# EasyEDA Pro project 51最小开发板.epro

# Schematic Schematic1
Board Name: Board1; Create Date: 2024-08-09; Page Name: P1; Project Name: 51最小开发板; Schematic Name: Schematic1; Update Date: 2024-08-25
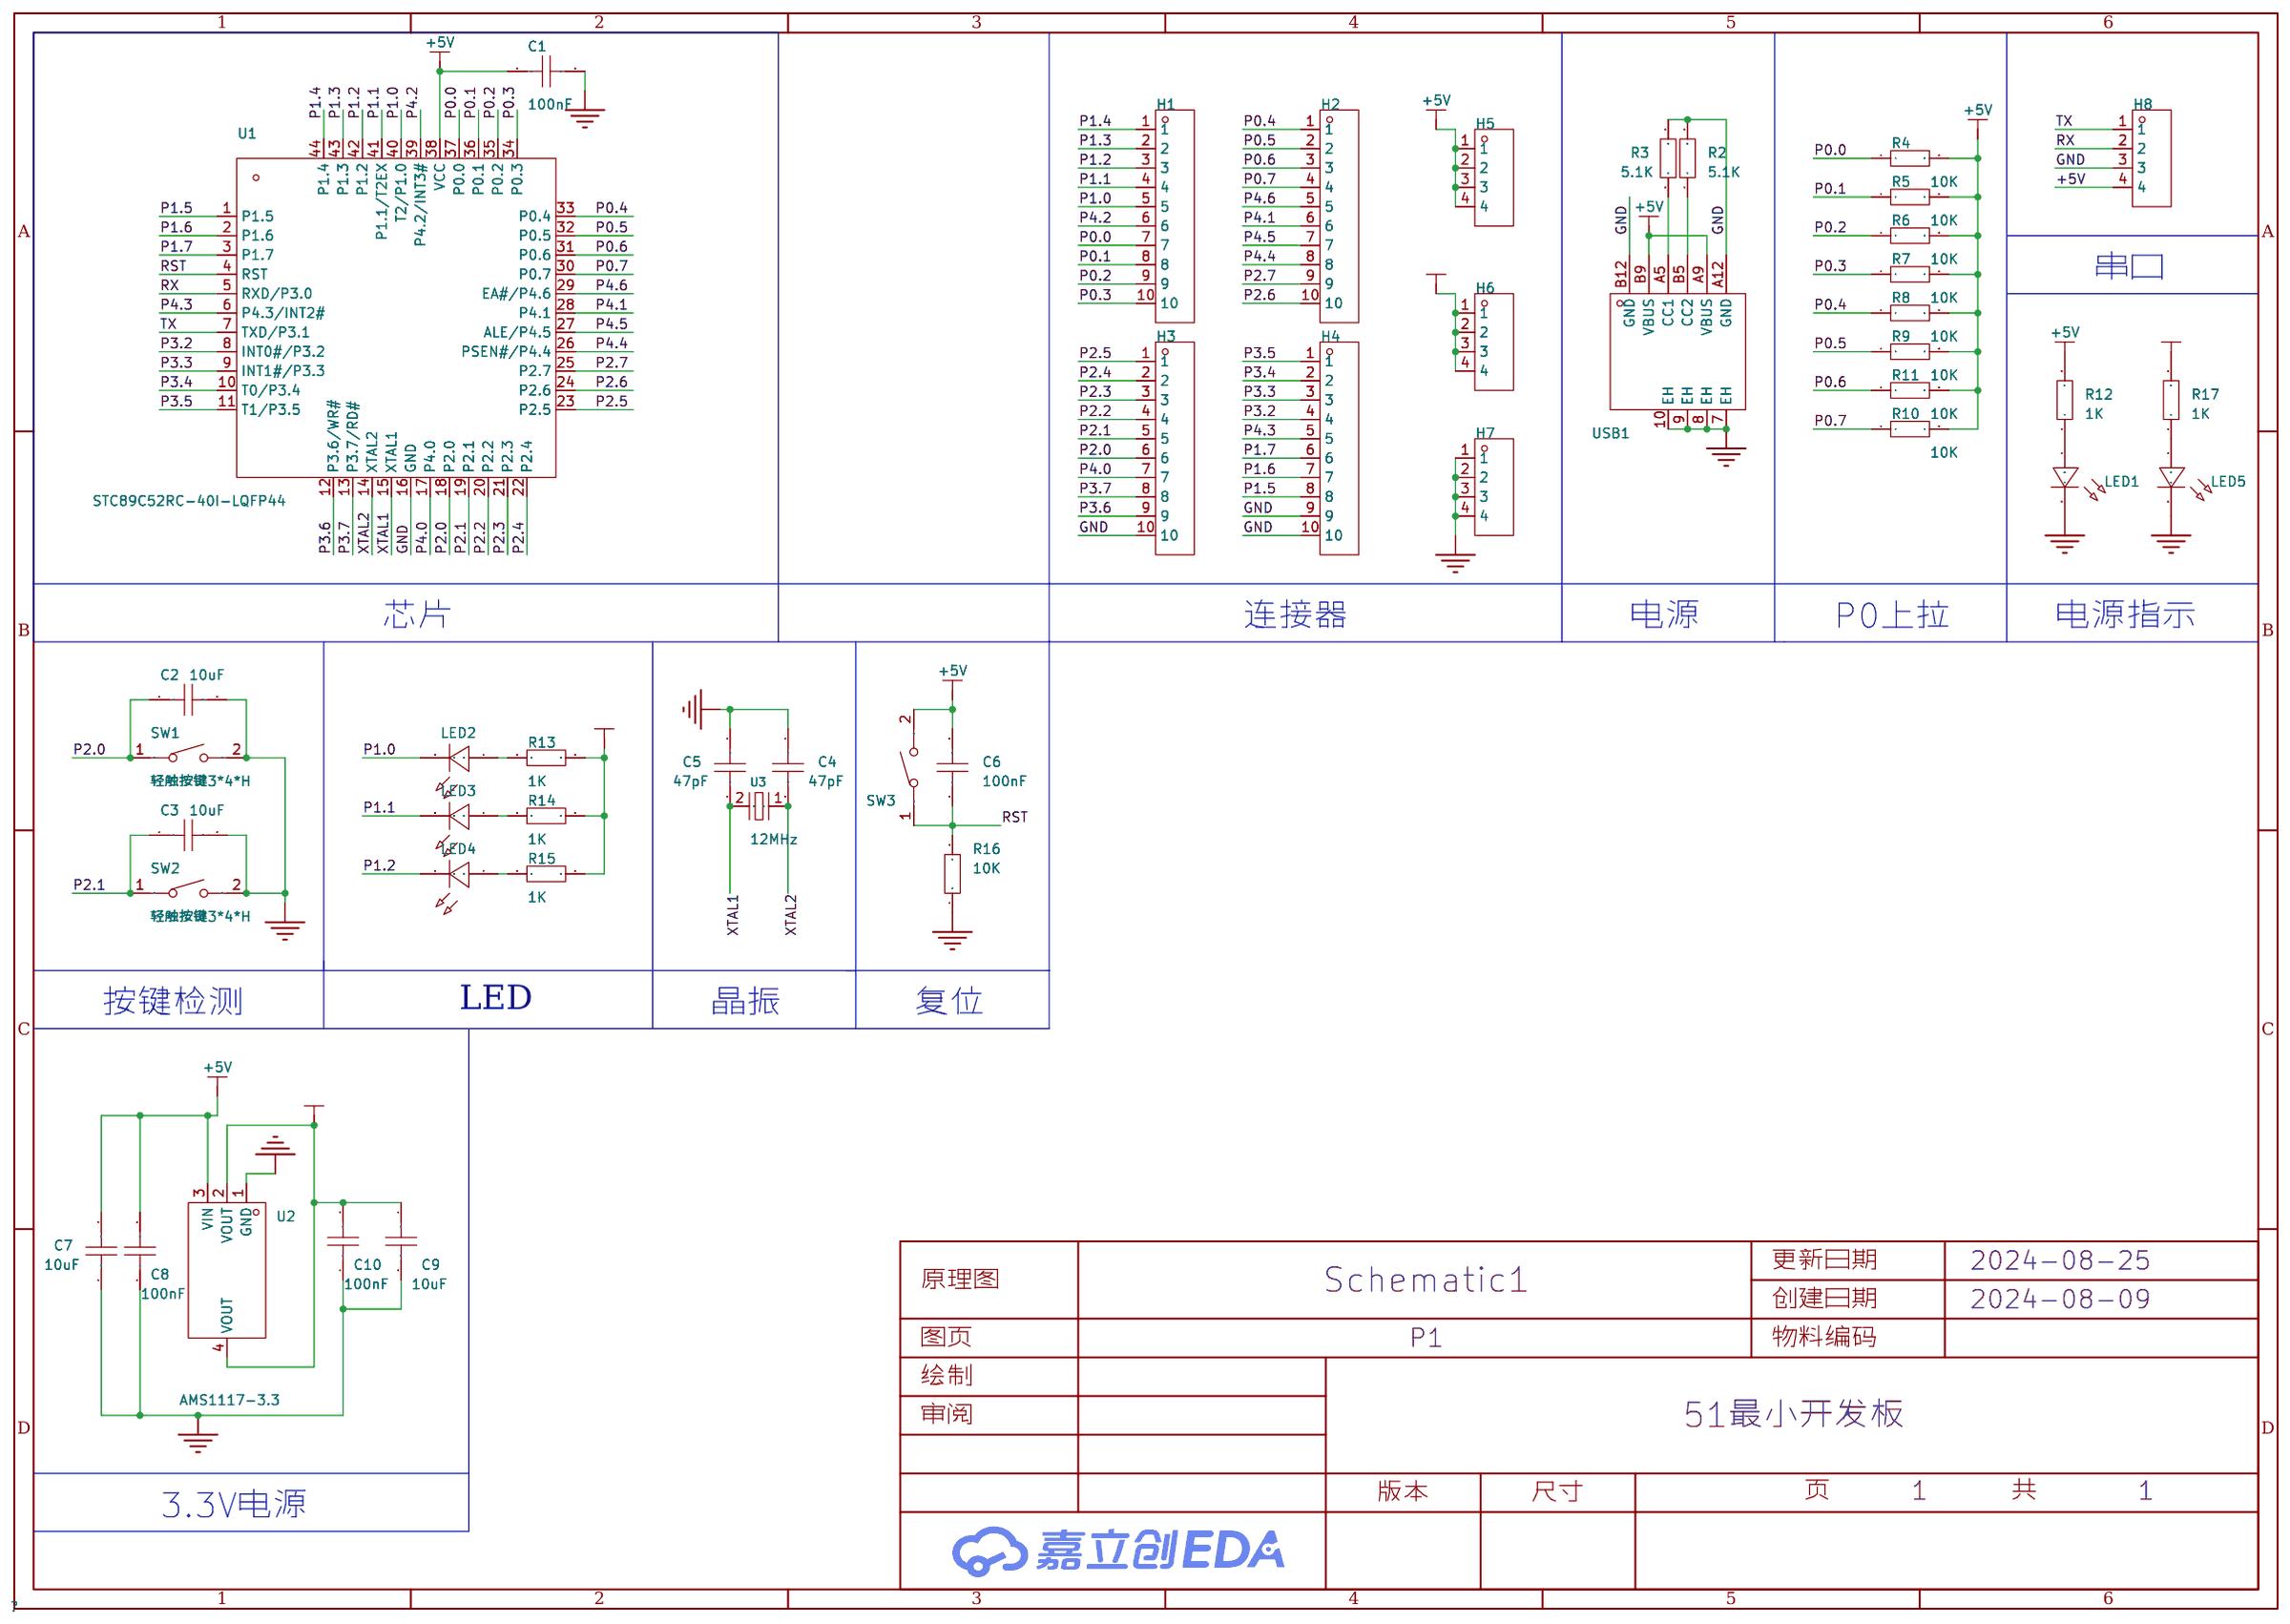
[diagram p0: schematic sheet]

## Parts
C1  100nF  [C0603]
C2  10uF  [C0603]
C3  10uF  [C0603]
C4  47pF  [C0603]
C5  47pF  [C0603]
C6  100nF  [C0603]
C7  10uF  [C0603]
C8  100nF  [C0603]
C9  10uF  [C0603]
C10  100nF  [C0603]
H1  -  [HDR-TH_10P-P2.54-V-F]
H2  -  [HDR-TH_10P-P2.54-V-F]
H3  -  [HDR-TH_10P-P2.54-V-F]
H4  -  [HDR-TH_10P-P2.54-V-F]
H5  -  [HDR-TH_4P-P2.54-V-F]
H6  -  [HDR-TH_4P-P2.54-V-F]
H7  -  [HDR-TH_4P-P2.54-V-F]
H8  -  [HDR-TH_4P-P2.54-V-M]
LED1  -  [LED_TH-3mm]
LED2  -  [LED_TH-3mm]
LED3  -  [LED_TH-3mm]
LED4  -  [LED_TH-3mm]
LED5  -  [LED_TH-3mm]
R2  5.1K  [R0603]
R3  5.1K  [R0603]
R4  10K  [R0603]
R5  10K  [R0603]
R6  10K  [R0603]
R7  10K  [R0603]
R8  10K  [R0603]
R9  10K  [R0603]
R10  10K  [R0603]
R11  10K  [R0603]
R12  1K  [R0603]
R13  1K  [R0603]
R14  1K  [R0603]
R15  1K  [R0603]
R16  10K  [R0603]
R17  1K  [R0603]
SW1  轻触按键3*4*H  [SW-SMD_L4.0-W2.9-LS5.0]
SW2  轻触按键3*4*H  [SW-SMD_L4.0-W2.9-LS5.0]
SW3  轻触按键3*4*H  [SW-SMD_L4.0-W2.9-LS5.0]
U1  STC89C52RC-40I-LQFP44  [LQFP-44_L10.0-W10.0-P0.80-LS12.0-BL]
U2  AMS1117-3.3  [SOT-223-3_L6.5-W3.4-P2.30-LS7.0-BR]
U3  12MHz  [CRYSTAL-SMD_L11.4-W4.7-LS12.7]
USB1  -  [USB_ TYPE-C-6P]

## Library data of the parts
C1-C10 = CAP_0603: Supplier Footprint: 0603
H1-H4 = HDR-F_2.54_1x10P: Supplier Part: C57369; Supplier Footprint: 插件
H5-H7 = HDR-F_2.54_1x4P: Supplier Part: C2718488; Supplier Footprint: 插件
H8 = HDR-M_2.54_1x4P: Supplier Part: C492403; Supplier Footprint: 插件
LED1-LED5 = LED_TH-R_3mm: Supplier Footprint: 插件
R2-R17 = Res_0603: Supplier Footprint: 0603
SW1-SW3 = 轻触按键3*4*H: Supplier Part: C9900017573; Supplier Footprint: 轻触按键3*4*2.5; JLCPCB Part Class: 扩展库; Supplier: LCSC
U1 = STC89C52RC-40I-LQFP44: CPU内核:51系列;程序存储容量:8KB;RAM总容量:512Byte;GPIO端口数量:39;工作电压范围:3.3V~5.5V;CPU最大主频:-;程序存储器类型:FLASH;; Supplier Part: C8707; Manufacturer: STC(宏晶); Supplier Footprint: LQFP-44(10x10); JLCPCB Part Class: 扩展库; Datasheet: https://atta.szlcsc.com/upload/public/pdf/source/20131218/1457706663573.pdf; Supplier: LCSC; CPU Core: 51系列; Program Storage Size: 8KB; RAM Size: 512Byte; GPIO Ports Number: 39; Operating Voltage Range: 3.3V~5.5V; Program Memory Type: FLASH; Operating Temperature Range: -40℃~+85℃; 16Bit Timer: 3; UART/USART: 1; Peripheral/Function: 看门狗; Watchdog: 有
U2 = AMS1117-3.3_C6186: 输出类型:固定;最大输入电压:-;输出电压:3.3V;最大输出电流:1A;电源纹波抑制比(PSRR):72dB@(120Hz);输出极性:正极;; LCSC Part Name: 输出3.3V 1A; Supplier Part: C6186; Manufacturer: AMS; Supplier Footprint: SOT-223; JLCPCB Part Class: 基础库; Datasheet: https://atta.szlcsc.com/upload/public/pdf/source/20180727/C6186_7A095716F0823C02F1997A905E26C086.pdf; Supplier: LCSC; Output Type: 固定; Output Voltage: 3.3V; MAX Output Current: 1A; Power Supply Rejection Ratio (PSRR): 72dB@(120Hz); Dropout Voltage: 1.3V@(800mA); Output Polarity: 正极; Number of Outputs: 1
U3 = ABLS-12.000MHZ-B4H-T: 频率:12MHz;常温频差:±30ppm;外接负载电容:18pF;频率稳定度(全温):±35ppm;; LCSC Part Name: 12MHz ±30ppm 18pF; Supplier Part: C1986452; Manufacturer: ABRACON; Supplier Footprint: HC-49S-SMD; JLCPCB Part Class: 扩展库; Datasheet: https://atta.szlcsc.com/upload/public/pdf/source/20210612/96A8D0E14BE5C26ADD56CBF11909D043.pdf; Supplier: LCSC; Normal temperature Frequency Tolerance: ±30ppm; External load capacitor: 18pF; Frequency Stability(Full temperature range): ±35ppm; Equivalent Series Resistance (ESR): 50Ω; Operating Temperature: -20℃~+70℃
USB1 = USB_ Type-C-6P: Supplier Footprint: SMD

## Nets
+5V: C1.1 C6.2 C7.1 C8.2 H5.1 H5.2 H5.3 H5.4 H8.4 R4.2 R5.2 R6.2 R7.2 R8.2 R9.2 R10.2 R11.2 R12.2 SW3.2 U1.38(VCC) U2.3(VIN) USB1.A9(VBUS) USB1.B9(VBUS)
GND: C1.2 C2.2 C3.2 C4.1 C5.1 C7.2 C8.1 C9.2 C10.1 H3.10 H4.9 H4.10 H7.1 H7.2 H7.3 H7.4 H8.3 LED1.2(A) LED5.2(A) R2.2 R3.2 R16.1 SW1.2 SW2.2 U1.16(GND) U2.1(GND) USB1.7(EH) USB1.8(EH) USB1.9(EH) USB1.10(EH) USB1.A12(GND) USB1.B12(GND)
VCC_3.3: C9.1 C10.2 H6.1 H6.2 H6.3 H6.4 R13.2 R14.2 R15.2 R17.2 U2.2(VOUT) U2.4(VOUT)
P0.0: H1.7 R4.1 U1.37(P0.0)
P0.1: H1.8 R5.1 U1.36(P0.1)
P0.2: H1.9 R6.1 U1.35(P0.2)
P0.3: H1.10 R7.1 U1.34(P0.3)
P0.4: H2.1 R8.1 U1.33(P0.4)
P0.5: H2.2 R9.1 U1.32(P0.5)
P0.6: H2.3 R11.1 U1.31(P0.6)
P0.7: H2.4 R10.1 U1.30(P0.7)
P1.0: H1.5 LED2.2(A) U1.40(T2/P1.0)
P1.1: H1.4 LED3.2(A) U1.41(P1.1/T2EX)
P1.2: H1.3 LED4.2(A) U1.42(P1.2)
P1.3: H1.2 U1.43(P1.3)
P1.4: H1.1 U1.44(P1.4)
P1.5: H4.8 U1.1(P1.5)
P1.6: H4.7 U1.2(P1.6)
P1.7: H4.6 U1.3(P1.7)
P2.0: C2.1 H3.6 SW1.1 U1.18(P2.0)
P2.1: C3.1 H3.5 SW2.1 U1.19(P2.1)
P2.2: H3.4 U1.20(P2.2)
P2.3: H3.3 U1.21(P2.3)
P2.4: H3.2 U1.22(P2.4)
P2.5: H3.1 U1.23(P2.5)
P2.6: H2.10 U1.24(P2.6)
P2.7: H2.9 U1.25(P2.7)
P3.2: H4.4 U1.8(INT0#/P3.2)
P3.3: H4.3 U1.9(INT1#/P3.3)
P3.4: H4.2 U1.10(T0/P3.4)
P3.5: H4.1 U1.11(T1/P3.5)
P3.6: H3.9 U1.12(P3.6/WR#)
P3.7: H3.8 U1.13(P3.7/RD#)
P4.0: H3.7 U1.17(P4.0)
P4.1: H2.6 U1.28(P4.1)
P4.2: H1.6 U1.39(P4.2/INT3#)
P4.3: H4.5 U1.6(P4.3/INT2#)
P4.4: H2.8 U1.26(PSEN#/P4.4)
P4.5: H2.7 U1.27(ALE/P4.5)
P4.6: H2.5 U1.29(EA#/P4.6)
RST: C6.1 R16.2 SW3.1 U1.4(RST)
RX: H8.2 U1.5(RXD/P3.0)
TX: H8.1 U1.7(TXD/P3.1)
XTAL1: C5.2 U1.15(XTAL1) U3.2(GND)
XTAL2: C4.2 U1.14(XTAL2) U3.1
Net-(LED1-1): LED1.1(C) R12.1
Net-(LED2-1): LED2.1(C) R13.1
Net-(LED3-1): LED3.1(C) R14.1
Net-(LED4-1): LED4.1(C) R15.1
Net-(LED5-1): LED5.1(C) R17.1
Net-(R2-1): R2.1 USB1.B5(CC2)
Net-(R3-1): R3.1 USB1.A5(CC1)

## Notes on the sheet
- 串口
- 芯片
- 连接器
- 电源
- P0上拉
- 电源指示
- 按键检测
- LED
- 晶振
- 复位
- 3.3V电源
